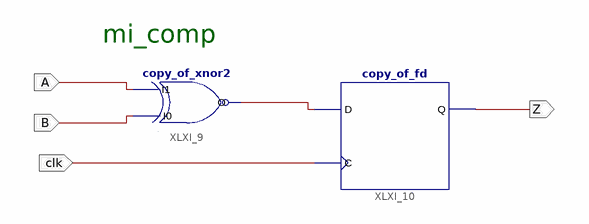
[diagram p0: schematic sheet 1]
// Xilinx ISE schematic sch_comparador.sch (artix7) as structural Verilog: 2 symbols, 4 ports
module sch_comparador (
  input  A,
  input  B,
  input  clk,
  output Z
);

  wire XLXN_1;

  copy_of_xnor2 XLXI_9 (.I0(B), .I1(A), .O(XLXN_1));
  copy_of_fd XLXI_10 (.C(clk), .D(XLXN_1), .Q(Z));

  // Notes on the sheet:
  //   mi_comp
endmodule
